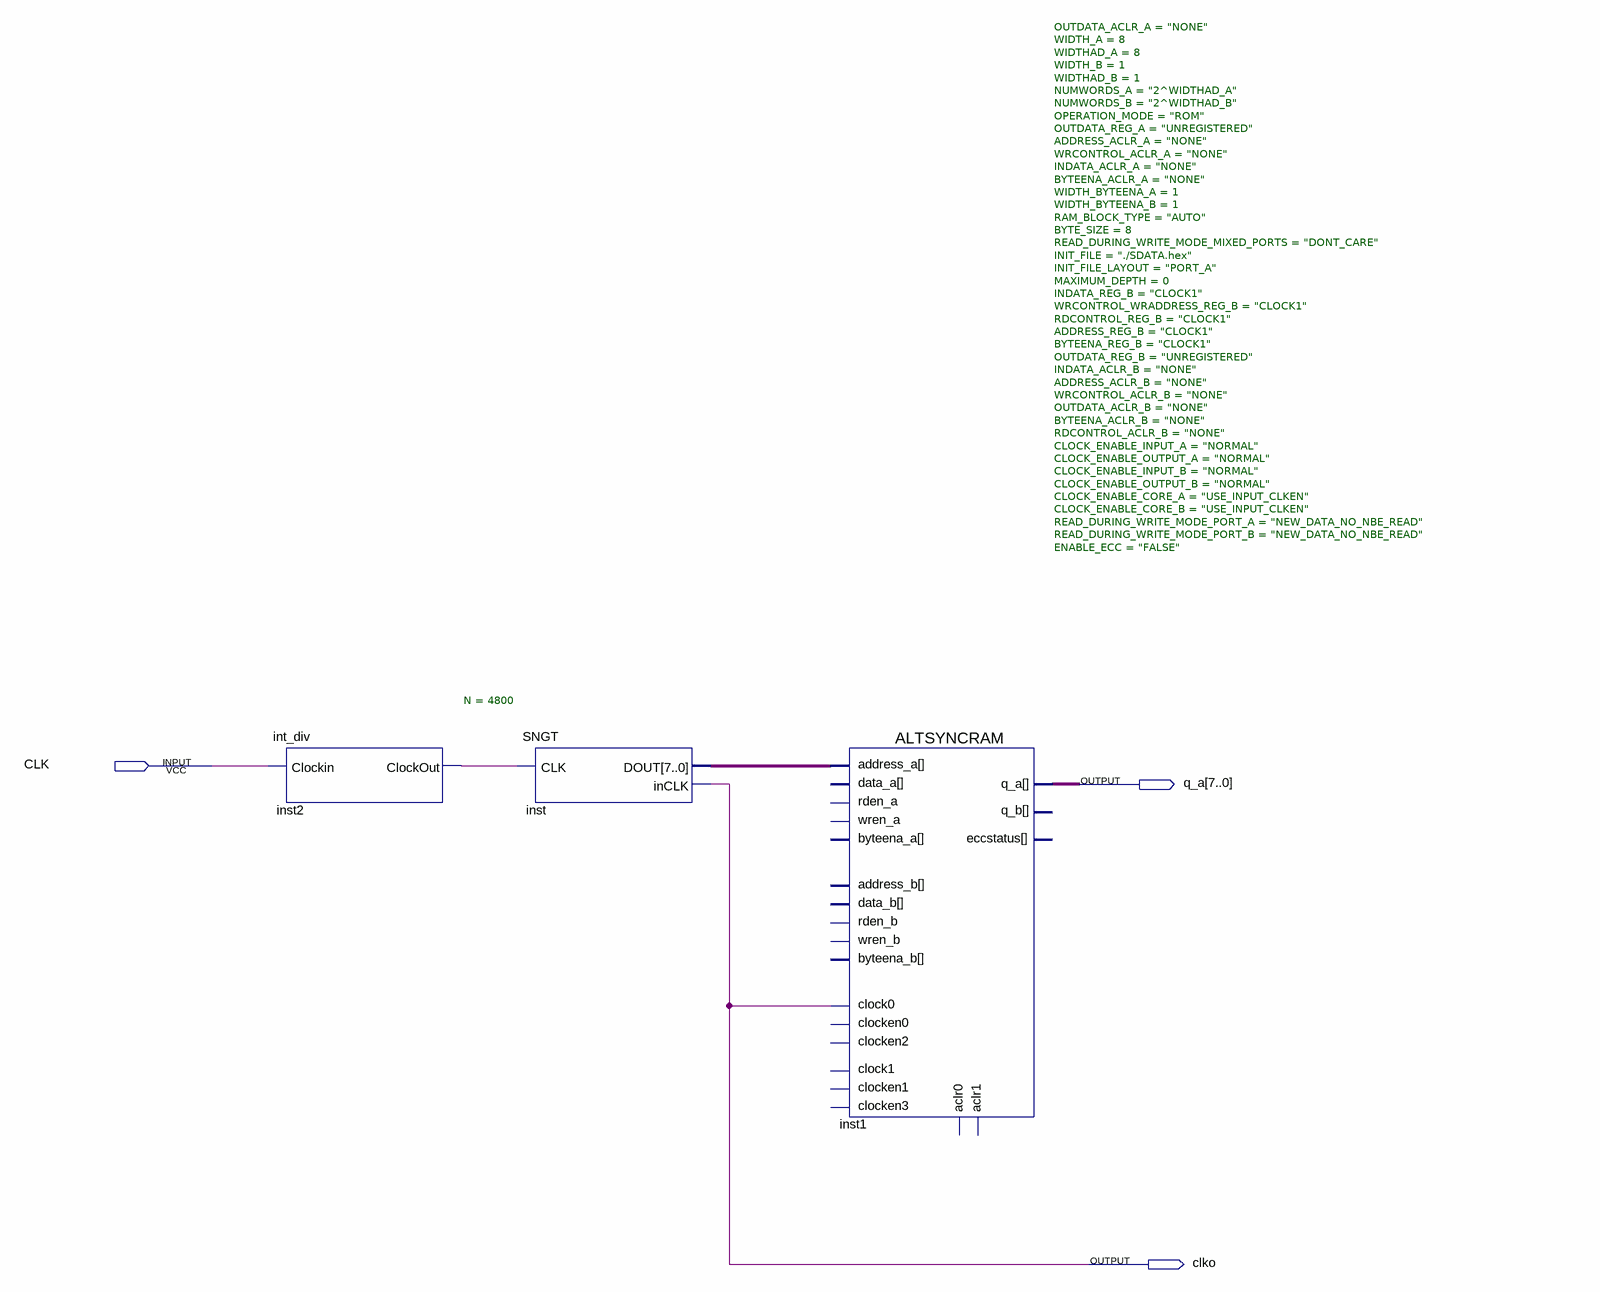
[diagram p0: schematic sheet]
// Quartus schematic SIN.bdf as structural Verilog: 3 symbols, 3 pins
module SIN (
  input  CLK,
  output [7:0] q_a,
  output clko
);

  wire inst2_clockout;
  wire [7:0] inst_dout;

  int_div #(.N(4800)) inst2 (.Clockin(CLK), .ClockOut(inst2_clockout));
  SNGT inst (.CLK(inst2_clockout), .DOUT(inst_dout), .inCLK(clko));
  ALTSYNCRAM #(.OUTDATA_ACLR_A("NONE"), .WIDTH_A(8), .WIDTHAD_A(8), .WIDTH_B(1), .WIDTHAD_B(1), .NUMWORDS_A("2^WIDTHAD_A"), .NUMWORDS_B("2^WIDTHAD_B"), .OPERATION_MODE("ROM"), .OUTDATA_REG_A("UNREGISTERED"), .ADDRESS_ACLR_A("NONE"), .WRCONTROL_ACLR_A("NONE"), .INDATA_ACLR_A("NONE"), .BYTEENA_ACLR_A("NONE"), .WIDTH_BYTEENA_A(1), .WIDTH_BYTEENA_B(1), .RAM_BLOCK_TYPE("AUTO"), .BYTE_SIZE(8), .READ_DURING_WRITE_MODE_MIXED_PORTS("DONT_CARE"), .INIT_FILE("./SDATA.hex"), .INIT_FILE_LAYOUT("PORT_A"), .MAXIMUM_DEPTH(0), .INDATA_REG_B("CLOCK1"), .WRCONTROL_WRADDRESS_REG_B("CLOCK1"), .RDCONTROL_REG_B("CLOCK1"), .ADDRESS_REG_B("CLOCK1"), .BYTEENA_REG_B("CLOCK1"), .OUTDATA_REG_B("UNREGISTERED"), .INDATA_ACLR_B("NONE"), .ADDRESS_ACLR_B("NONE"), .WRCONTROL_ACLR_B("NONE"), .OUTDATA_ACLR_B("NONE"), .BYTEENA_ACLR_B("NONE"), .RDCONTROL_ACLR_B("NONE"), .CLOCK_ENABLE_INPUT_A("NORMAL"), .CLOCK_ENABLE_OUTPUT_A("NORMAL"), .CLOCK_ENABLE_INPUT_B("NORMAL"), .CLOCK_ENABLE_OUTPUT_B("NORMAL"), .CLOCK_ENABLE_CORE_A("USE_INPUT_CLKEN"), .CLOCK_ENABLE_CORE_B("USE_INPUT_CLKEN"), .READ_DURING_WRITE_MODE_PORT_A("NEW_DATA_NO_NBE_READ"), .READ_DURING_WRITE_MODE_PORT_B("NEW_DATA_NO_NBE_READ"), .ENABLE_ECC("FALSE")) inst1 (
    .address_a(inst_dout), .clock0(clko), .q_a(q_a));  // open: wren_a, byteena_a, data_b, rden_b, wren_b, byteena_b, clocken0, clock1, clocken1, aclr0, aclr1, data_a, address_b, clocken3, clocken2, rden_a, q_b, eccstatus
endmodule
